# EAGLE design USB hub & FTDI (EAGLE 9.6.1)
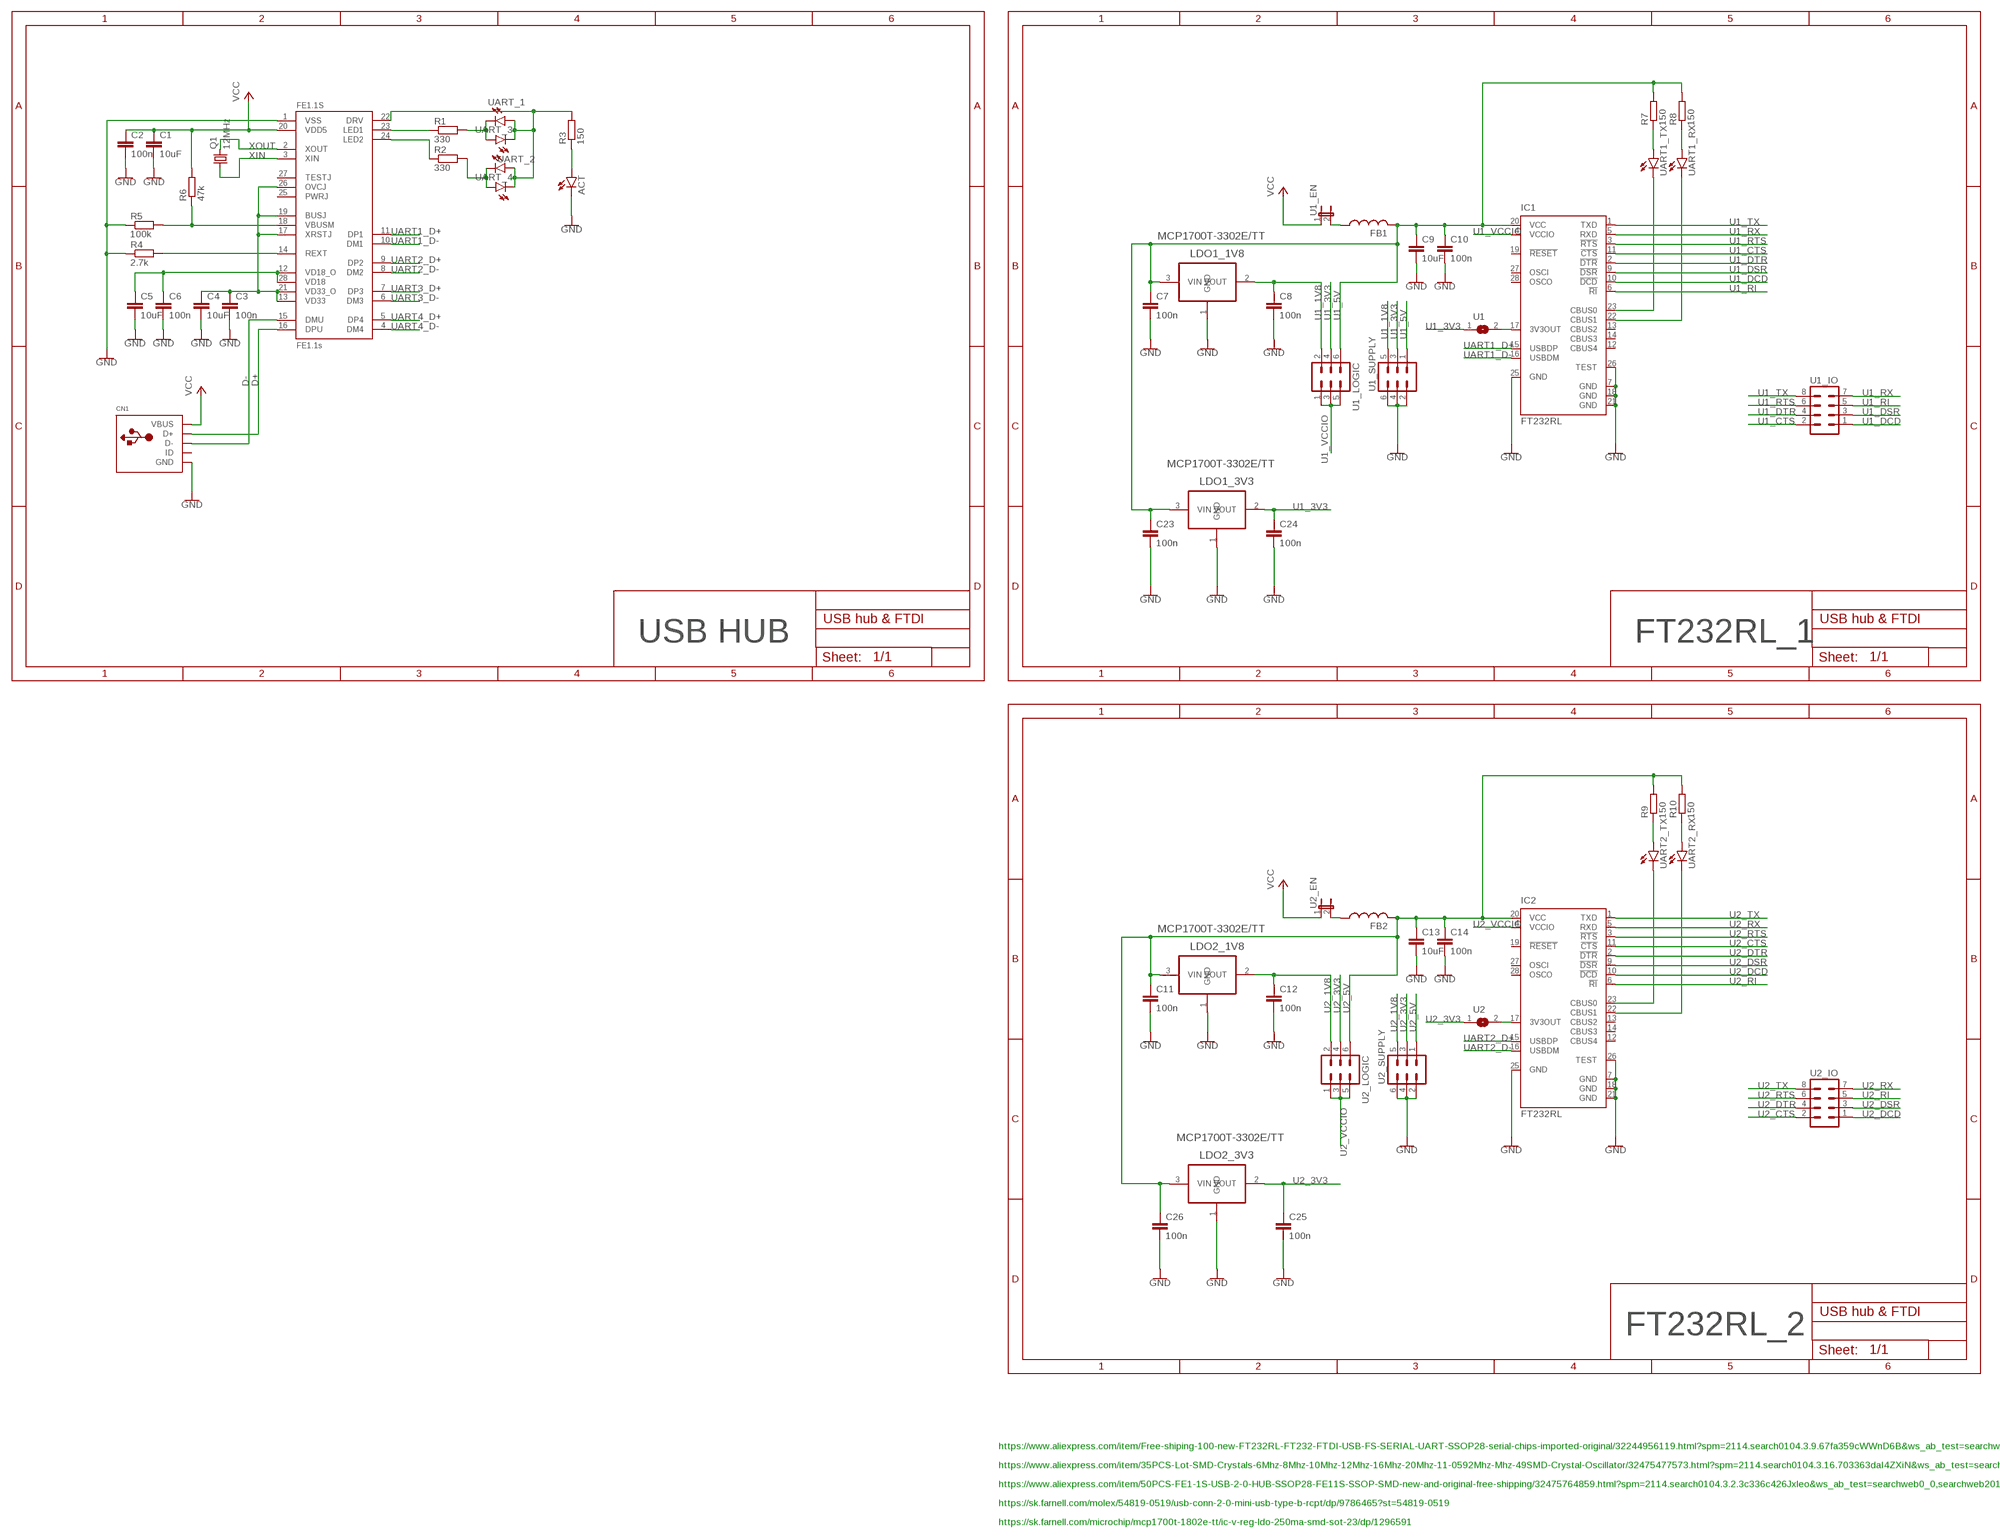
[diagram p0: schematic, sheet 1, part 1 of 2]
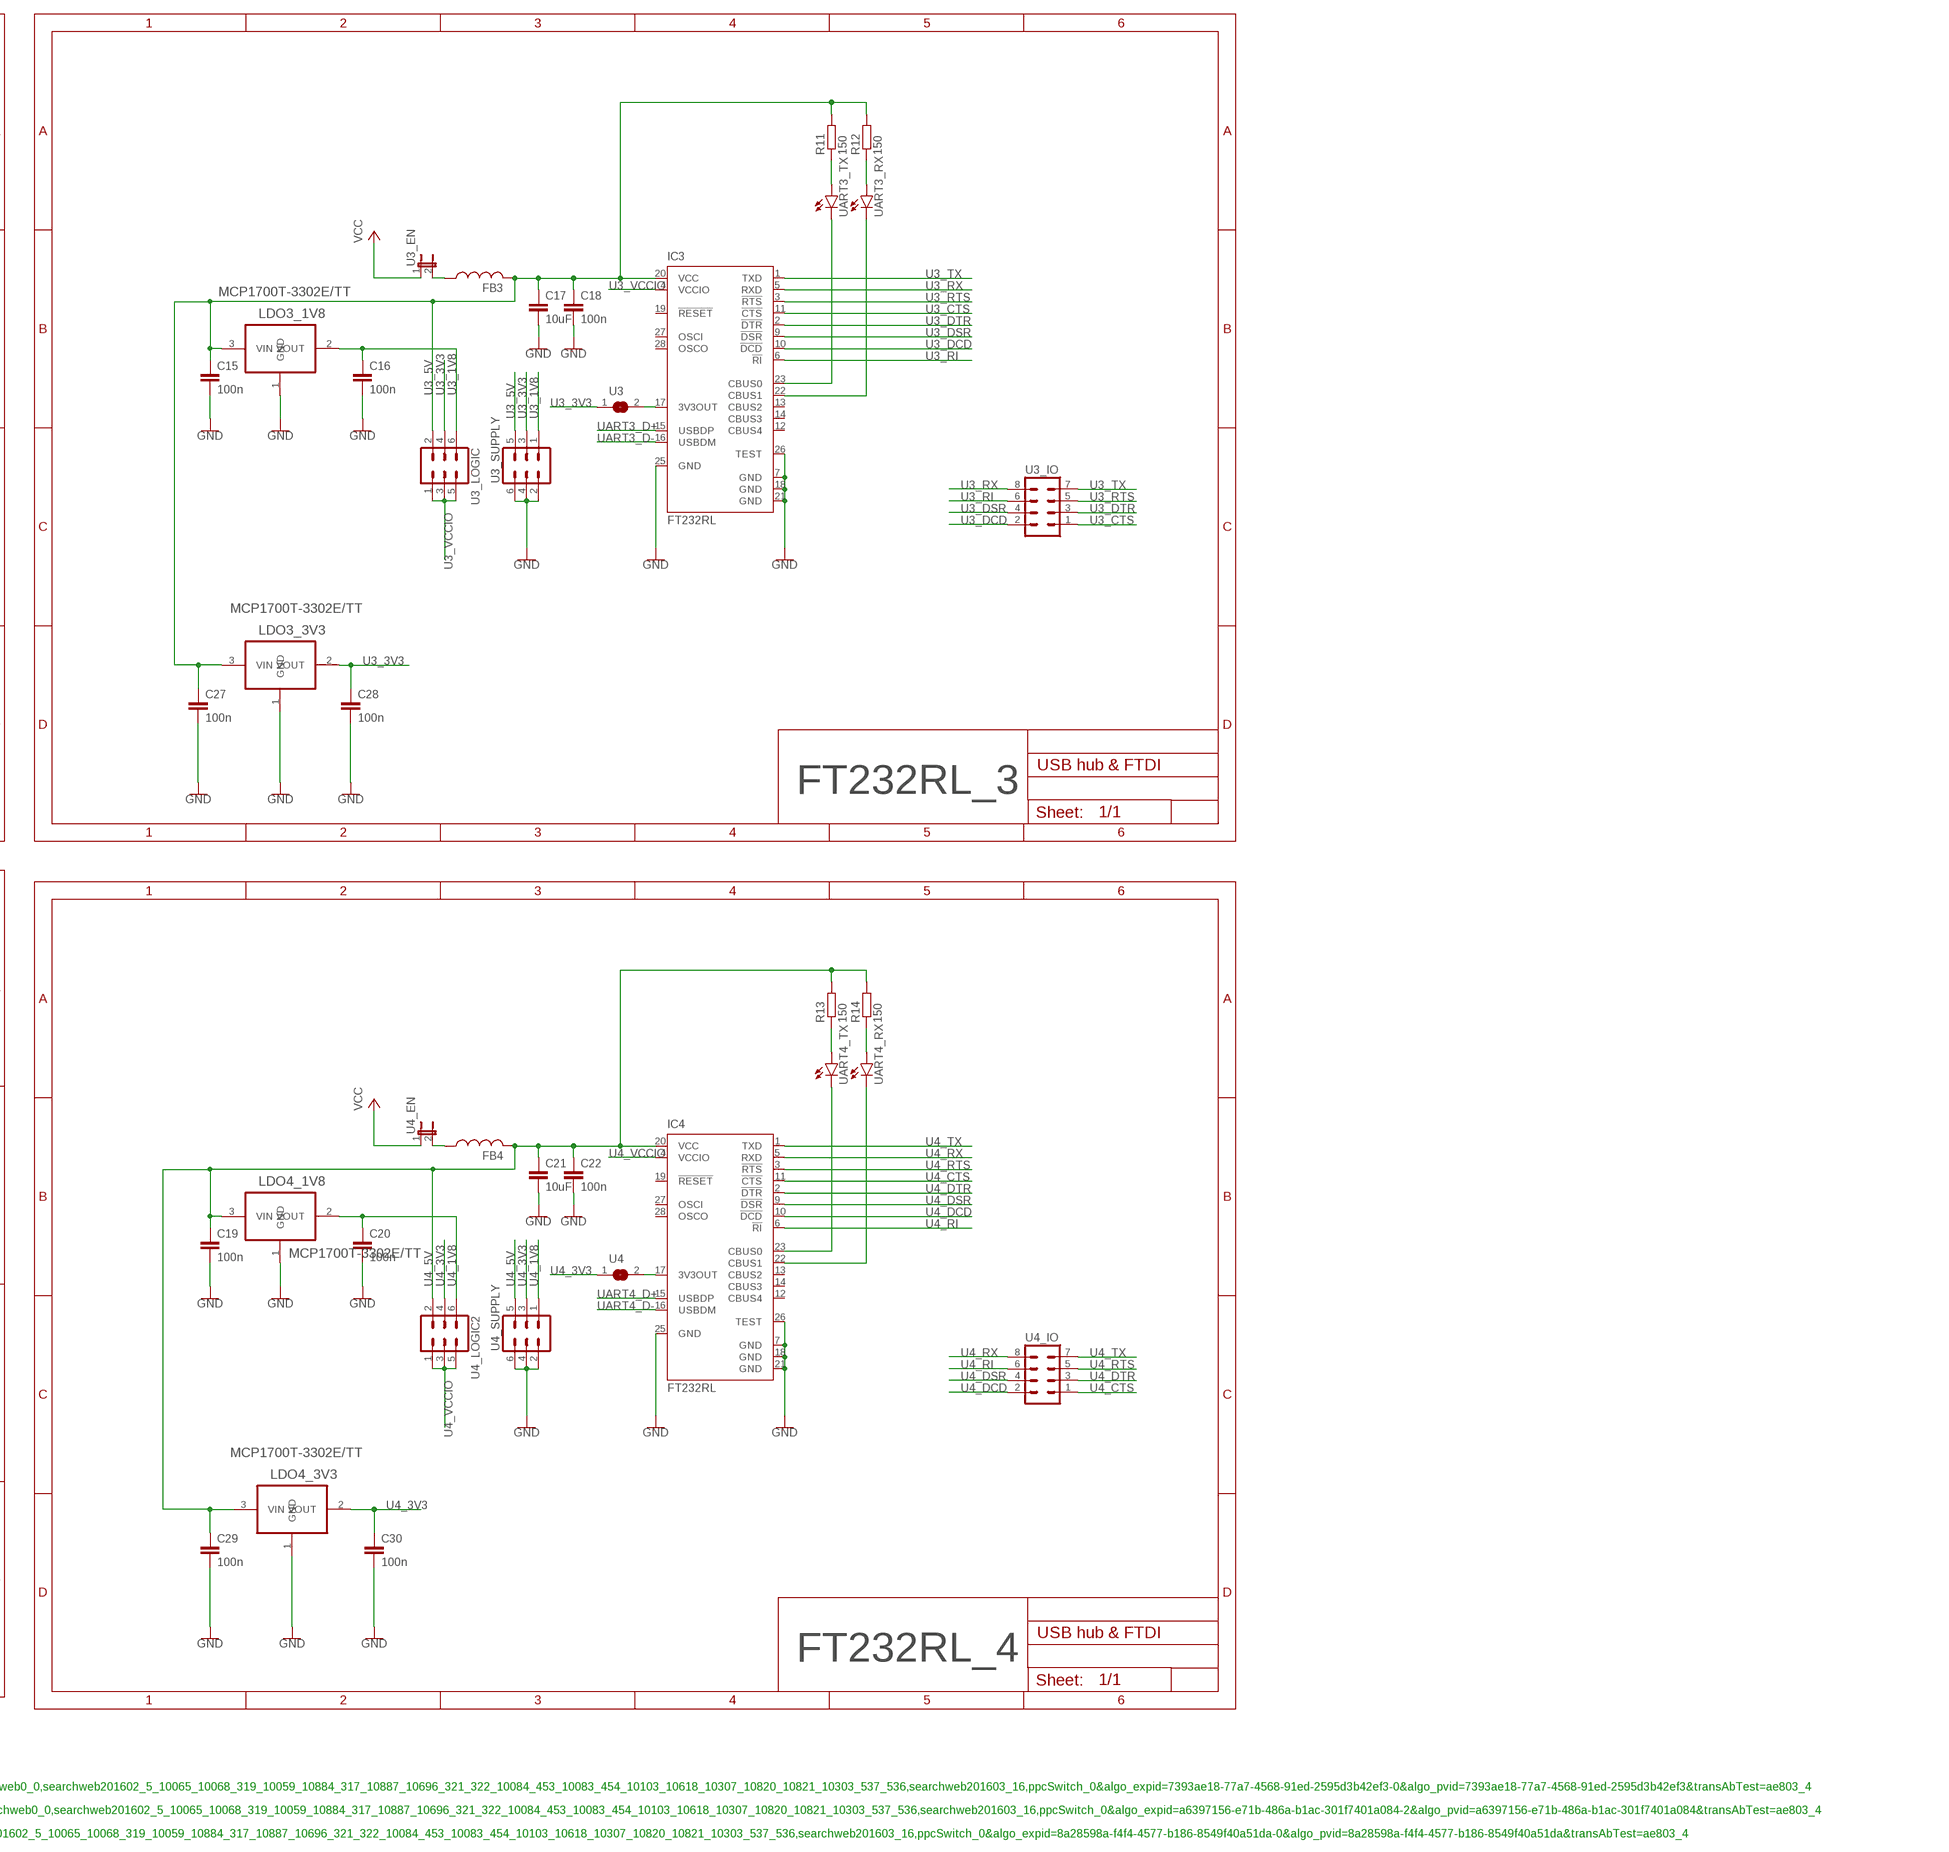
[diagram p1: schematic, sheet 1, part 2 of 2]

## Parts
ACT  LEDCHIP-LED0805  [CHIP-LED0805]
C1  10uF  C-EUC0805  [C0805]
C2  100n  C-EUC0805  [C0805]
C3  100n  C-EUC0805  [C0805]
C4  10uF  C-EUC0805  [C0805]
C5  10uF  C-EUC0805  [C0805]
C6  100n  C-EUC0805  [C0805]
C7  100n  C-EUC0805  [C0805]
C8  100n  C-EUC0805  [C0805]
C9  10uF  C-EUC0805  [C0805]
C10  100n  C-EUC0805  [C0805]
C11  100n  C-EUC0805  [C0805]
C12  100n  C-EUC0805  [C0805]
C13  10uF  C-EUC0805  [C0805]
C14  100n  C-EUC0805  [C0805]
C15  100n  C-EUC0805  [C0805]
C16  100n  C-EUC0805  [C0805]
C17  10uF  C-EUC0805  [C0805]
C18  100n  C-EUC0805  [C0805]
C19  100n  C-EUC0805  [C0805]
C20  100n  C-EUC0805  [C0805]
C21  10uF  C-EUC0805  [C0805]
C22  100n  C-EUC0805  [C0805]
C23  100n  C-EUC0805  [C0805]
C24  100n  C-EUC0805  [C0805]
C25  100n  C-EUC0805  [C0805]
C26  100n  C-EUC0805  [C0805]
C27  100n  C-EUC0805  [C0805]
C28  100n  C-EUC0805  [C0805]
C29  100n  C-EUC0805  [C0805]
C30  100n  C-EUC0805  [C0805]
CN1  USBMOLEX  [USB-MINIB-THM-MOLEX]
FB1  FERRITE-BEADB  [0805]
FB2  FERRITE-BEADB  [0805]
FB3  FERRITE-BEADB  [0805]
FB4  FERRITE-BEADB  [0805]
FE1.1S  FE1.1S  [FE1.1S_SSOP-28]
IC1  FT232RL  [SSOP28]
IC2  FT232RL  [SSOP28]
IC3  FT232RL  [SSOP28]
IC4  FT232RL  [SSOP28]
LDO1_1V8  MCP1700T-3302E/TT  [SOT95P237X112-3N]
LDO1_3V3  MCP1700T-3302E/TT  [SOT95P237X112-3N]
LDO2_1V8  MCP1700T-3302E/TT  [SOT95P237X112-3N]
LDO2_3V3  MCP1700T-3302E/TT  [SOT95P237X112-3N]
LDO3_1V8  MCP1700T-3302E/TT  [SOT95P237X112-3N]
LDO3_3V3  MCP1700T-3302E/TT  [SOT95P237X112-3N]
LDO4_1V8  MCP1700T-3302E/TT  [SOT95P237X112-3N]
LDO4_3V3  MCP1700T-3302E/TT  [SOT95P237X112-3N]
Q1  12MHz  CRYSTALHC49UP  [HC49UP]
R1  330  R-EU_R0805W  [R0805W]
R2  330  R-EU_R0805W  [R0805W]
R3  150  R-EU_R0805W  [R0805W]
R4  2.7k  R-EU_R0805W  [R0805W]
R5  100k  R-EU_R0805W  [R0805W]
R6  47k  R-EU_R0805W  [R0805W]
R7  150  R-EU_R0805W  [R0805W]
R8  150  R-EU_R0805W  [R0805W]
R9  150  R-EU_R0805W  [R0805W]
R10  150  R-EU_R0805W  [R0805W]
R11  150  R-EU_R0805W  [R0805W]
R12  150  R-EU_R0805W  [R0805W]
R13  150  R-EU_R0805W  [R0805W]
R14  150  R-EU_R0805W  [R0805W]
U1  SJ  [SJ]
U1_EN  JP1E  [JP1]
U1_IO  MA04-2  [MA04-2]
U1_LOGIC  MA03-2  [MA03-2]
U1_SUPPLY  MA03-2  [MA03-2]
U2  SJ  [SJ]
U2_EN  JP1E  [JP1]
U2_IO  MA04-2  [MA04-2]
U2_LOGIC  MA03-2  [MA03-2]
U2_SUPPLY  MA03-2  [MA03-2]
U3  SJ  [SJ]
U3_EN  JP1E  [JP1]
U3_IO  MA04-2  [MA04-2]
U3_LOGIC  MA03-2  [MA03-2]
U3_SUPPLY  MA03-2  [MA03-2]
U4  SJ  [SJ]
U4_EN  JP1E  [JP1]
U4_IO  MA04-2  [MA04-2]
U4_LOGIC2  MA03-2  [MA03-2]
U4_SUPPLY  MA03-2  [MA03-2]
UART1_RX  LEDCHIP-LED0805  [CHIP-LED0805]
UART1_TX  LEDCHIP-LED0805  [CHIP-LED0805]
UART2_RX  LEDCHIP-LED0805  [CHIP-LED0805]
UART2_TX  LEDCHIP-LED0805  [CHIP-LED0805]
UART3_RX  LEDCHIP-LED0805  [CHIP-LED0805]
UART3_TX  LEDCHIP-LED0805  [CHIP-LED0805]
UART4_RX  LEDCHIP-LED0805  [CHIP-LED0805]
UART4_TX  LEDCHIP-LED0805  [CHIP-LED0805]
UART_1  LEDCHIP-LED0805  [CHIP-LED0805]
UART_2  LEDCHIP-LED0805  [CHIP-LED0805]
UART_3  LEDCHIP-LED0805  [CHIP-LED0805]
UART_4  LEDCHIP-LED0805  [CHIP-LED0805]

## Nets
D+: CN1.D+ FE1.1S.16(DPU)
D-: CN1.D- FE1.1S.15(DMU)
GND: ACT.C C1.2 C2.2 C3.2 C4.2 C5.2 C6.2 C7.2 C8.2 C9.2 C10.2 C11.2 C12.2 C13.2 C14.2 C15.2 C16.2 C17.2 C18.2 C19.2 C20.2 C21.2 C22.2 C23.2 C24.2 C25.2 C26.2 C27.2 C28.2 C29.2 C30.2 CN1.GND FE1.1S.1(VSS) IC1.7(GND) IC1.18(GND) IC1.21(GND) IC1.25(GND) IC1.26(TEST) IC2.7(GND) IC2.18(GND) IC2.21(GND) IC2.25(GND) IC2.26(TEST) IC3.7(GND) IC3.18(GND) IC3.21(GND) IC3.25(GND) IC3.26(TEST) IC4.7(GND) IC4.18(GND) IC4.21(GND) IC4.25(GND) IC4.26(TEST) LDO1_1V8.1(GND) LDO1_3V3.1(GND) LDO2_1V8.1(GND) LDO2_3V3.1(GND) LDO3_1V8.1(GND) LDO3_3V3.1(GND) LDO4_1V8.1(GND) LDO4_3V3.1(GND) R4.1 R5.1 U1_SUPPLY.2 U1_SUPPLY.4 U1_SUPPLY.6 U2_SUPPLY.2 U2_SUPPLY.4 U2_SUPPLY.6 U3_SUPPLY.2 U3_SUPPLY.4 U3_SUPPLY.6 U4_SUPPLY.2 U4_SUPPLY.4 U4_SUPPLY.6
N$1: FE1.1S.23(LED1) R1.1
N$2: FE1.1S.24(LED2) R2.1
N$3: R1.2 UART_1.C UART_3.A
N$4: R2.2 UART_2.C UART_4.A
N$5: C5.1 C6.1 FE1.1S.12(VD18_O) FE1.1S.28(VD18)
N$6: R9.1 UART2_TX.A
N$7: FE1.1S.22(DRV) R3.2 UART_1.A UART_2.A UART_3.C UART_4.C
N$8: R7.1 UART1_TX.A
N$9: ACT.A R3.1
N$10: FE1.1S.18(VBUSM) R5.2 R6.1
N$11: FE1.1S.14(REXT) R4.2
N$12: C3.1 C4.1 FE1.1S.13(VD33) FE1.1S.17(XRSTJ) FE1.1S.19(BUSJ) FE1.1S.21(VD33_O) FE1.1S.26(OVCJ)
N$13: R8.1 UART1_RX.A
N$14: IC1.23(CBUS0) UART1_TX.C
N$15: IC1.22(CBUS1) UART1_RX.C
N$16: R10.1 UART2_RX.A
N$17: IC2.23(CBUS0) UART2_TX.C
N$18: IC2.22(CBUS1) UART2_RX.C
N$19: FB2.1 U2_EN.2
N$20: R11.1 UART3_TX.A
N$21: R12.1 UART3_RX.A
N$22: IC3.23(CBUS0) UART3_TX.C
N$23: IC3.22(CBUS1) UART3_RX.C
N$24: FB3.1 U3_EN.2
N$25: FB1.1 U1_EN.2
N$26: R13.1 UART4_TX.A
N$27: R14.1 UART4_RX.A
N$28: IC4.23(CBUS0) UART4_TX.C
N$29: IC4.22(CBUS1) UART4_RX.C
N$30: FB4.1 U4_EN.2
N$31: IC1.17(3V3OUT) U1.2
N$32: IC2.17(3V3OUT) U2.2
N$33: IC3.17(3V3OUT) U3.2
N$35: IC4.17(3V3OUT) U4.2
U1_1V8: C8.1 LDO1_1V8.2(VOUT) U1_LOGIC.2 U1_SUPPLY.5
U1_3V3: C24.1 LDO1_3V3.2(VOUT) U1.1 U1_LOGIC.4 U1_SUPPLY.3
U1_5V: C7.1 C9.1 C10.1 C23.1 FB1.2 IC1.20(VCC) LDO1_1V8.3(VIN) LDO1_3V3.3(VIN) R7.2 R8.2 U1_LOGIC.6 U1_SUPPLY.1
U1_CTS: IC1.11(!CTS) U1_IO.2
U1_DCD: IC1.10(!DCD) U1_IO.1
U1_DSR: IC1.9(!DSR) U1_IO.3
U1_DTR: IC1.2(!DTR) U1_IO.4
U1_RI: IC1.6(!RI) U1_IO.5
U1_RTS: IC1.3(!RTS) U1_IO.6
U1_RX: IC1.5(RXD) U1_IO.7
U1_TX: IC1.1(TXD) U1_IO.8
U1_VCCIO: IC1.4(VCCIO) U1_LOGIC.1 U1_LOGIC.3 U1_LOGIC.5
U2_1V8: C12.1 LDO2_1V8.2(VOUT) U2_LOGIC.2 U2_SUPPLY.5
U2_3V3: C25.1 LDO2_3V3.2(VOUT) U2.1 U2_LOGIC.4 U2_SUPPLY.3
U2_5V: C11.1 C13.1 C14.1 C26.1 FB2.2 IC2.20(VCC) LDO2_1V8.3(VIN) LDO2_3V3.3(VIN) R9.2 R10.2 U2_LOGIC.6 U2_SUPPLY.1
U2_CTS: IC2.11(!CTS) U2_IO.2
U2_DCD: IC2.10(!DCD) U2_IO.1
U2_DSR: IC2.9(!DSR) U2_IO.3
U2_DTR: IC2.2(!DTR) U2_IO.4
U2_RI: IC2.6(!RI) U2_IO.5
U2_RTS: IC2.3(!RTS) U2_IO.6
U2_RX: IC2.5(RXD) U2_IO.7
U2_TX: IC2.1(TXD) U2_IO.8
U2_VCCIO: IC2.4(VCCIO) U2_LOGIC.1 U2_LOGIC.3 U2_LOGIC.5
U3_1V8: C16.1 LDO3_1V8.2(VOUT) U3_LOGIC.6 U3_SUPPLY.1
U3_3V3: C28.1 LDO3_3V3.2(VOUT) U3.1 U3_LOGIC.4 U3_SUPPLY.3
U3_5V: C15.1 C17.1 C18.1 C27.1 FB3.2 IC3.20(VCC) LDO3_1V8.3(VIN) LDO3_3V3.3(VIN) R11.2 R12.2 U3_LOGIC.2 U3_SUPPLY.5
U3_CTS: IC3.11(!CTS) U3_IO.1
U3_DCD: IC3.10(!DCD) U3_IO.2
U3_DSR: IC3.9(!DSR) U3_IO.4
U3_DTR: IC3.2(!DTR) U3_IO.3
U3_RI: IC3.6(!RI) U3_IO.6
U3_RTS: IC3.3(!RTS) U3_IO.5
U3_RX: IC3.5(RXD) U3_IO.8
U3_TX: IC3.1(TXD) U3_IO.7
U3_VCCIO: IC3.4(VCCIO) U3_LOGIC.1 U3_LOGIC.3 U3_LOGIC.5
U4_1V8: C20.1 LDO4_1V8.2(VOUT) U4_LOGIC2.6 U4_SUPPLY.1
U4_3V3: C30.1 LDO4_3V3.2(VOUT) U4.1 U4_LOGIC2.4 U4_SUPPLY.3
U4_5V: C19.1 C21.1 C22.1 C29.1 FB4.2 IC4.20(VCC) LDO4_1V8.3(VIN) LDO4_3V3.3(VIN) R13.2 R14.2 U4_LOGIC2.2 U4_SUPPLY.5
U4_CTS: IC4.11(!CTS) U4_IO.1
U4_DCD: IC4.10(!DCD) U4_IO.2
U4_DSR: IC4.9(!DSR) U4_IO.4
U4_DTR: IC4.2(!DTR) U4_IO.3
U4_RI: IC4.6(!RI) U4_IO.6
U4_RTS: IC4.3(!RTS) U4_IO.5
U4_RX: IC4.5(RXD) U4_IO.8
U4_TX: IC4.1(TXD) U4_IO.7
U4_VCCIO: IC4.4(VCCIO) U4_LOGIC2.1 U4_LOGIC2.3 U4_LOGIC2.5
UART1_D+: FE1.1S.11(DP1) IC1.15(USBDP)
UART1_D-: FE1.1S.10(DM1) IC1.16(USBDM)
UART2_D+: FE1.1S.9(DP2) IC2.15(USBDP)
UART2_D-: FE1.1S.8(DM2) IC2.16(USBDM)
UART3_D+: FE1.1S.7(DP3) IC3.15(USBDP)
UART3_D-: FE1.1S.6(DM3) IC3.16(USBDM)
UART4_D+: FE1.1S.5(DP4) IC4.15(USBDP)
UART4_D-: FE1.1S.4(DM4) IC4.16(USBDM)
VCC: C1.1 C2.1 CN1.VBUS FE1.1S.20(VDD5) R6.2 U1_EN.1 U2_EN.1 U3_EN.1 U4_EN.1
XIN: FE1.1S.3(XIN) Q1.1
XOUT: FE1.1S.2(XOUT) Q1.2
Unconnected: CN1.ID FE1.1S.25(PWRJ) FE1.1S.27(TESTJ) IC1.12(CBUS4) IC1.13(CBUS2) IC1.14(CBUS3) IC1.19(!RESET) IC1.27(OSCI) IC1.28(OSCO) IC2.12(CBUS4) IC2.13(CBUS2) IC2.14(CBUS3) IC2.19(!RESET) IC2.27(OSCI) IC2.28(OSCO) IC3.12(CBUS4) IC3.13(CBUS2) IC3.14(CBUS3) IC3.19(!RESET) IC3.27(OSCI) IC3.28(OSCO) IC4.12(CBUS4) IC4.13(CBUS2) IC4.14(CBUS3) IC4.19(!RESET) IC4.27(OSCI) IC4.28(OSCO)

## Notes on the sheet
- USB HUB | FT232RL_1 | FT232RL_3
- FT232RL_2 | FT232RL_4
- https://www.aliexpress.com/item/Free-shiping-100-new-FT232RL-FT232-FTDI-USB-FS-SERIAL-UART-SSOP28-serial-chips-imported-original/32244956119.html?spm=2114.search0104.3.9.67fa359cWWnD6B&ws_ab_test=searchweb0_0,searchweb201602_5_10065_10068_319_10059_10884_317_10887_10696_321_322_10084_453_10083_454_10103_10618_10307_10820_10821_10303_537_536,searchweb201603_16,ppcSwitch_0&algo_expid=7393ae18-77a7-4568-91ed-2595d3b42ef3-0&algo_pvid=7393ae18-77a7-4568-91ed-2595d3b42ef3&transAbTest=ae803_4
- https://www.aliexpress.com/item/35PCS-Lot-SMD-Crystals-6Mhz-8Mhz-10Mhz-12Mhz-16Mhz-20Mhz-11-0592Mhz-Mhz-49SMD-Crystal-Oscillator/32475477573.html?spm=2114.search0104.3.16.703363daI4ZXiN&ws_ab_test=searchweb0_0,searchweb201602_5_10065_10068_319_10059_10884_317_10887_10696_321_322_10084_453_10083_454_10103_10618_10307_10820_10821_10303_537_536,searchweb201603_16,ppcSwitch_0&algo_expid=a6397156-e71b-486a-b1ac-301f7401a084-2&algo_pvid=a6397156-e71b-486a-b1ac-301f7401a084&transAbTest=ae803_4
- https://www.aliexpress.com/item/50PCS-FE1-1S-USB-2-0-HUB-SSOP28-FE11S-SSOP-SMD-new-and-original-free-shipping/32475764859.html?spm=2114.search0104.3.2.3c336c426Jxleo&ws_ab_test=searchweb0_0,searchweb201602_5_10065_10068_319_10059_10884_317_10887_10696_321_322_10084_453_10083_454_10103_10618_10307_10820_10821_10303_537_536,searchweb201603_16,ppcSwitch_0&algo_expid=8a28598a-f4f4-4577-b186-8549f40a51da-0&algo_pvid=8a28598a-f4f4-4577-b186-8549f40a51da&transAbTest=ae803_4
- https://sk.farnell.com/molex/54819-0519/usb-conn-2-0-mini-usb-type-b-rcpt/dp/9786465?st=54819-0519
- https://sk.farnell.com/microchip/mcp1700t-1802e-tt/ic-v-reg-ldo-250ma-smd-sot-23/dp/1296591

## Library data of the parts
ACT UART1_RX UART1_TX UART2_RX UART2_TX UART3_RX UART3_TX UART4_RX UART4_TX UART_1-UART_4 = led:LED: LED OSRAM: - CHIPLED LG R971, LG N971, LY N971, LG Q971, LY Q971, LO R971, LY R971 LH N974, LH R974 LS Q976, LO Q976, LY Q976 LO Q996 - Hyper CHIPLED LW Q18S LB Q993, LB Q99A, LB R99A - SideLED LS A670, LO A670, LY A670, LG A670, LP A670 LB A673, LV A673, LT A673, LW A673 LH A674 LY A675 LS A676, LA A676, LO A676, LY A676, LW A676 LS A679, LY A679, LG A679 - Hyper Micro SIDELED® LS Y876, LA Y876, LO Y876, LY Y876 LT Y87S - SmartLED LW L88C, LW L88S LB L89C, LB L89S, LG L890 LS L89K, LO L89K, LY L89K LS L896, LA L896, LO L896, LY L896 - TOPLED LS T670, LO T670, LY T670, LG T670, LP T670 LSG T670, LSP T670, LSY T670, LOP T670, LYG T670 LG T671, LOG T671, LSG T671 LB T673, LV T673, LT T673, LW T673 LH T674 LS T676, LA T676, LO T676, LY T676, LB T676, LH T676, LSB T676, LW T676 LB T67C, LV T67C, LT T67C, LS T67K, LO T67K, LY T67K, LW E67C LS E67B, LA E67B, LO E67B, LY E67B, LB E67C, LV E67C, LT E67C LW T67C LS T679, LY T679, LG T679 LS T770, LO T770, LY T770, LG T770, LP T770 LB T773, LV T773, LT T773, LW T773 LH T774 LS E675, LA E675, LY E675, LS T675 LS T776, LA T776, LO T776, LY T776, LB T776 LHGB T686 LT T68C, LB T68C - Hyper Mini TOPLED® LB M676 - Mini TOPLED Santana® LG M470 LS M47K, LO M47K, LY M47K Source: http://www.osram.convergy.de LUXEON: - LUMILED® LXK2-PW12-R00, LXK2-PW12-S00, LXK2-PW14-U00, LXK2-PW14-V00 LXK2-PM12-R00, LXK2-PM12-S00, LXK2-PM14-U00 LXK2-PE12-Q00, LXK2-PE12-R00, LXK2-PE12-S00, LXK2-PE14-T00, LXK2-PE14-U00 LXK2-PB12-K00, LXK2-PB12-L00, LXK2-PB12-M00, LXK2-PB14-N00, LXK2-PB14-P00, LXK2-PB14-Q00 LXK2-PR12-L00, LXK2-PR12-M00, LXK2-PR14-Q00, LXK2-PR14-R00 LXK2-PD12-Q00, LXK2-PD12-R00, LXK2-PD12-S00 LXK2-PH12-R00, LXK2-PH12-S00 LXK2-PL12-P00, LXK2-PL12-Q00, LXK2-PL12-R00 Source: www.luxeon.com KINGBRIGHT: KA-3528ASYC Source: www.kingbright.com
C1-C30 = rcl:C-EU: CAPACITOR, European symbol; SPICEPREFIX: C
CN1 = adafruit:USB: USB Connectors USBMINIB - Surface Mount Female Mini-B USB Connector 4UConnector: 06564 By microbuilder.eu Thru-hole RA Female Mini-B USB Connector 4UConnector: 18732 By ladyada.net
FB1-FB4 = m-pad-2.1:FERRITE-BEAD: Ferrite beads in various packages
FE1.1S = Ai_IC:FE1.1S
IC1-IC4 = ftdichip:FT232R: Source: http://www.ftdichip.com/Documents/DataSheets/DS_FT232R_v104.pdf; MPN: FT232RL; OC_FARNELL: 1146032; OC_NEWARK: 91K9918
LDO1_1V8 LDO1_3V3 LDO2_1V8 LDO2_3V3 LDO3_1V8 LDO3_3V3 LDO4_1V8 LDO4_3V3 = MCP1700T-3302E_TT:MCP1700T-3302E/TT: Low Quiescent Current LDO; AVAILABILITY: Unavailable; DESCRIPTION: MCP1700 Series 250 mA 3.3 V Fixed Output LDO Voltage Regulator - SOT-23; MF: Microchip; MP: MCP1700T-3302E/TT; PACKAGE: SOT-23-3 Microchip; PRICE: None
Q1 = adafruit:CRYSTAL: CRYSTAL; OC_FARNELL: unknown; OC_NEWARK: unknown
R1-R14 = rcl:R-EU_: RESISTOR, European symbol; SPICEPREFIX: R
U1-U4 = jumper:SJ: SMD solder JUMPER
U1_EN U2_EN U3_EN U4_EN = jumper:JP1E: JUMPER
U1_IO U2_IO U3_IO U4_IO = con-lstb:MA04-2: PIN HEADER; OC_FARNELL: unknown; OC_NEWARK: unknown
U1_LOGIC U1_SUPPLY U2_LOGIC U2_SUPPLY U3_LOGIC U3_SUPPLY U4_LOGIC2 U4_SUPPLY = con-lstb:MA03-2: PIN HEADER; OC_FARNELL: unknown; OC_NEWARK: unknown

## Board
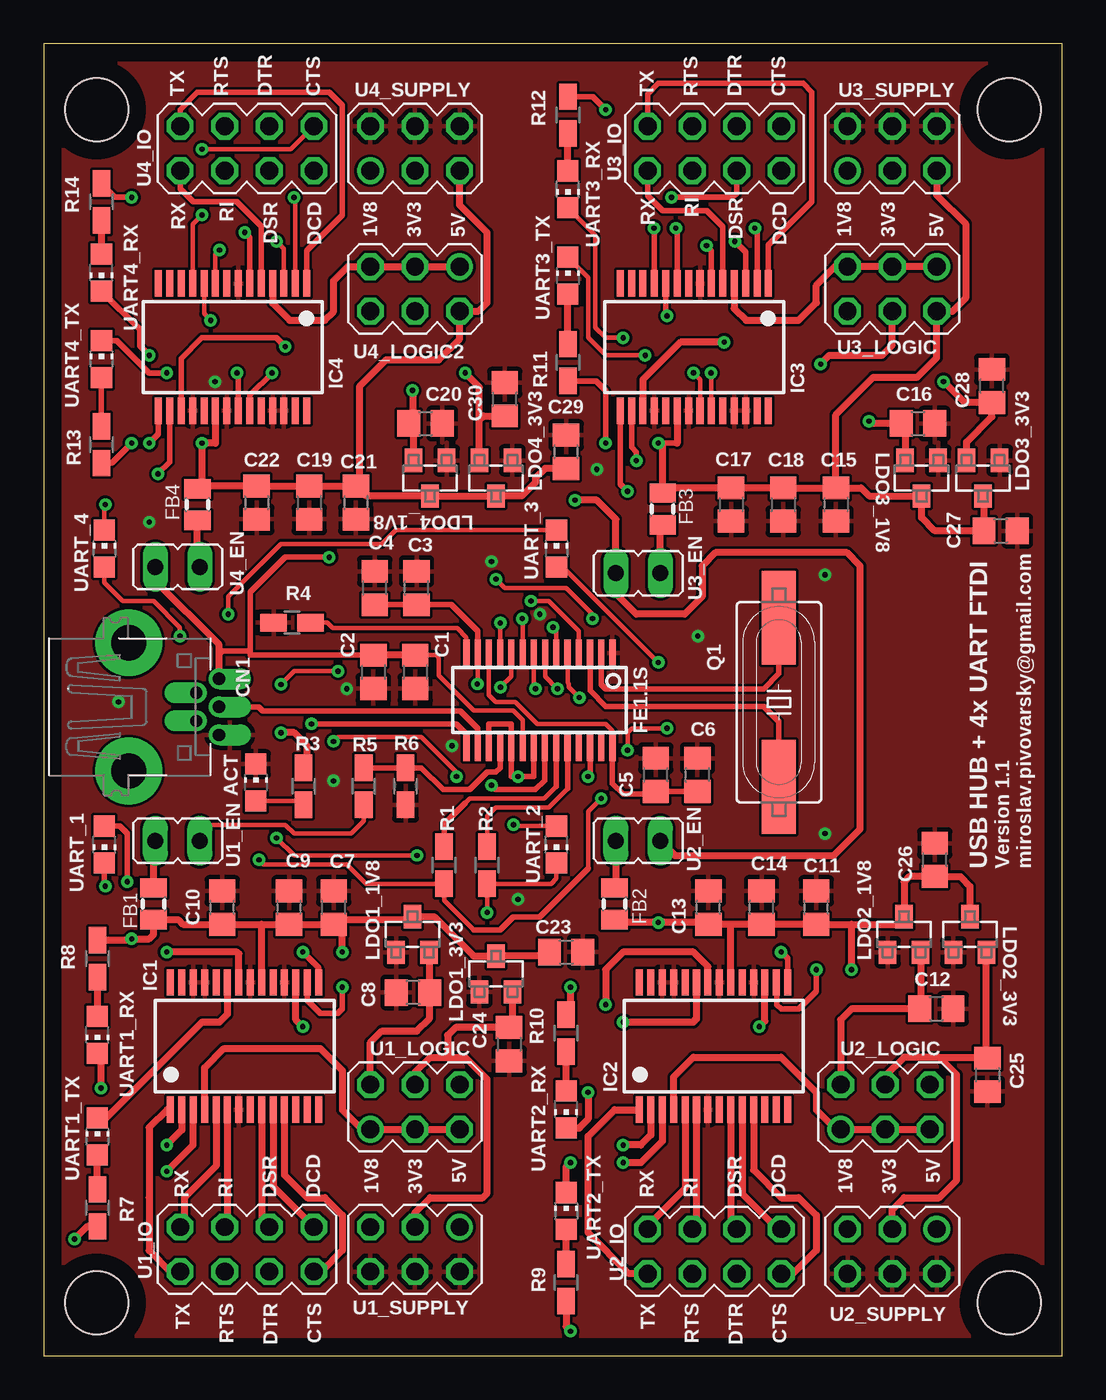
[diagram p2: board, top side]
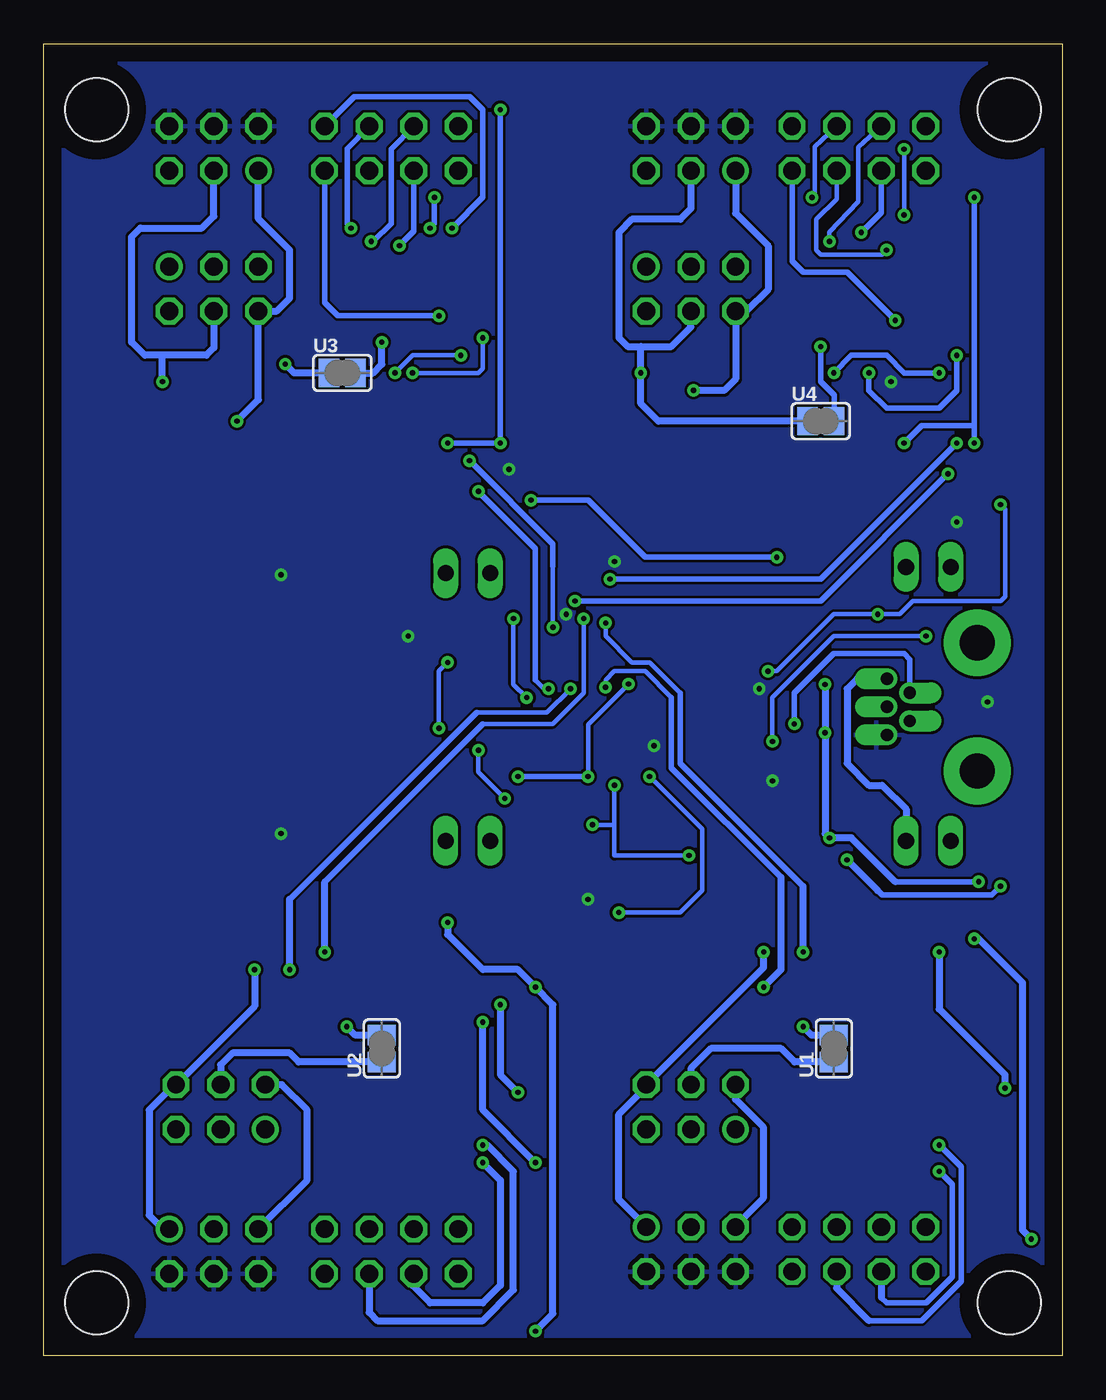
[diagram p3: board, bottom side, seen from below]

Size 58 x 74.75 mm. Coordinates in mm from the lower left corner, seen from the top.
Outline: 0,0 58,0 58,74.75 0,74.75 0,0
Copper layers (1*16): Top 0.035mm / dielectric 1.5mm / Bottom 0.035mm
Design rules "default *": minimum track width 6mil, minimum drill 0.35mm, track to track 6mil, track to pad 6mil, pad to pad 6mil, via to via 6mil, smd to smd 6mil, copper to edge 40mil, drill to drill 6mil, minimum pad ring 10mil, minimum via ring 8mil, stop-mask expansion 4mil, vias tented up to drill 66mil, thermal gap 10mil
Holes 3.6 mm at 55,71 3,71 3,3 55,3

### Footprints (pad centres in the part's own frame; a part is rotated, then mirrored left to right if it is on the bottom)
CHIP-LED0805 = smd 1.2 x 1.2: A 0,-1.05; C 0,1.05
C0805 = smd 1.3 x 1.5: 1 -0.95,0; 2 0.95,0
USB-MINIB-THM-MOLEX = drill 0.7 offset: D+ 0,9.72; D- -0.8,8.42; GND 1.6,9.72; ID 0.8,8.42; VBUS -1.6,9.72 | drill 2 pad 3.81: GND1 -3.65,4.57; GND4 3.65,4.57
0805 = smd 1.1 x 1.5: 1 -0.9,0; 2 0.9,0
FE1.1S_SSOP-28 = smd 0.35 x 1.5: 1 -4.16,-2.7; 2 -3.52,-2.7; 3 -2.88,-2.7; 4 -2.24,-2.7; 5 -1.6,-2.7; 6 -0.96,-2.7; 7 -0.32,-2.7; 8 0.32,-2.7; 9 0.96,-2.7; 10 1.6,-2.7; 11 2.24,-2.7; 12 2.88,-2.7; 13 3.52,-2.7; 14 4.16,-2.7; 15 4.16,2.7; 16 3.52,2.7; 17 2.88,2.7; 18 2.24,2.7; 19 1.6,2.7; 20 0.96,2.7; 21 0.32,2.7; 22 -0.3,2.7; 23 -0.96,2.7; 24 -1.6,2.7; 25 -2.24,2.7; 26 -2.88,2.7; 27 -3.52,2.7; 28 -4.16,2.7
SSOP28 = smd 0.4 x 1.5: 1 -4.225,-3.625; 2 -3.575,-3.625; 3 -2.925,-3.625; 4 -2.275,-3.625; 5 -1.625,-3.625; 6 -0.975,-3.625; 7 -0.325,-3.625; 8 0.325,-3.625; 9 0.975,-3.625; 10 1.625,-3.625; 11 2.275,-3.625; 12 2.925,-3.625; 13 3.575,-3.625; 14 4.225,-3.625; 15 4.225,3.625; 16 3.575,3.625; 17 2.925,3.625; 18 2.275,3.625; 19 1.625,3.625; 20 0.975,3.625; 21 0.325,3.625; 22 -0.325,3.625; 23 -0.975,3.625; 24 -1.625,3.625; 25 -2.275,3.625; 26 -2.925,3.625; 27 -3.575,3.625; 28 -4.225,3.625
SOT95P237X112-3N = smd 0.991 x 1.321: 1 -0.94,-1.016; 2 0.94,-1.016; 3 0,1.016
HC49UP = smd 5.334 x 1.93: 1 -4.826,0; 2 4.826,0
R0805W = smd 1.5 x 1: 1 -1.052,0; 2 1.052,0
SJ = smd 1.168 x 1.6: 1 -0.762,0; 2 0.762,0
JP1 = drill 0.914 long: 1 0,-1.27; 2 0,1.27
MA04-2 = drill 1.016 octagon: 1 -3.81,-1.27; 2 -3.81,1.27; 3 -1.27,-1.27; 4 -1.27,1.27; 5 1.27,-1.27; 6 1.27,1.27; 7 3.81,-1.27; 8 3.81,1.27
MA03-2 = drill 1.016: 1 -2.54,-1.27 | drill 1.016 octagon: 2 -2.54,1.27; 3 0,-1.27; 4 0,1.27; 5 2.54,-1.27; 6 2.54,1.27

### Placement (x,y rotation side)
ACT  12.08,32.66 0 top
C1  21.15,38.96 270 top
C2  18.77,38.96 270 top
C3  21.23,43.74 90 top
C4  18.85,43.74 90 top
C5  34.85,33.09 90 top
C6  37.23,33.09 90 top
C7  16.51,25.53 90 top
C8  21.03,20.69 180 top
C9  13.97,25.53 90 top
C10  10.16,25.53 90 top
C11  44,25.53 90 top
C12  50.84,19.77 0 top
C13  37.85,25.53 90 top
C14  40.88,25.53 90 top
C15  45.12,48.5 270 top
C16  49.79,53.12 0 top
C17  39.15,48.5 270 top
C18  42.12,48.5 270 top
C19  15.12,48.61 270 top
C20  21.74,53.12 0 top
C21  17.77,48.61 270 top
C22  12.12,48.61 270 top
C23  29.75,23 0 top
C24  26.5,17.75 270 top
C25  53.75,16 270 top
C26  50.75,28.25 90 top
C27  54.5,47 0 top
C28  54,55.25 90 top
C29  29.75,51.5 90 top
C30  26.25,54.5 90 top
CN1  0.26,36.97 270 top
FB1  6.25,25.75 270 top
FB2  32.5,25.75 270 top
FB3  35.25,48.25 90 top
FB4  8.75,48.5 90 top
FE1.1S  28.23,37.35 180 top
IC1  11.43,17.64 0 top
IC2  38.15,17.64 0 top
IC3  37.05,57.47 180 top
IC4  10.75,57.47 180 top
LDO1_1V8  21,24 0 top
LDO1_3V3  25.75,21.75 0 top
LDO2_1V8  49,24 0 top
LDO2_3V3  52.75,24 0 top
LDO3_1V8  50,50 180 top
LDO3_3V3  53.5,50 180 top
LDO4_1V8  22,50 180 top
LDO4_3V3  25.75,50 180 top
Q1  41.87,37.23 90 top
R1  22.8,27.94 270 top
R2  25.25,27.94 270 top
R3  14.8,32.44 90 top
R4  14.14,41.77 0 top
R5  20.6,32.44 90 top
R6  18.22,32.44 270 top
R7  3.05,8.42 270 top
R8  3.05,22.62 90 top
R9  29.75,4.17 270 top
R10  29.75,18.37 90 top
R11  29.85,56.59 270 top
R12  29.85,70.69 90 top
R13  3.28,51.91 270 top
R14  3.28,65.74 90 top
U1  13,17.5 90 bottom
U1_EN  7.62,29.34 90 top
U1_IO  11.57,6.06 180 top
U1_LOGIC  21.14,14.17 0 top
U1_SUPPLY  21.14,6.06 180 top
U2  38.75,17.5 90 bottom
U2_EN  33.85,29.34 90 top
U2_IO  38.2,5.94 180 top
U2_LOGIC  47.93,14.17 0 top
U2_SUPPLY  48.32,5.94 180 top
U3  41,56 0 bottom
U3_EN  33.85,44.59 270 top
U3_IO  38.2,68.79 180 top
U3_LOGIC  48.32,60.79 180 top
U3_SUPPLY  48.32,68.79 0 top
U4  13.75,53.25 0 bottom
U4_EN  7.62,44.94 270 top
U4_IO  11.57,68.79 180 top
U4_LOGIC2  21.14,60.79 180 top
U4_SUPPLY  21.14,68.79 0 top
UART1_RX  3.05,18.28 180 top
UART1_TX  3.05,12.49 0 top
UART2_RX  29.75,14.03 180 top
UART2_TX  29.75,8.24 0 top
UART3_RX  29.85,66.46 180 top
UART3_TX  29.85,61.54 0 top
UART4_RX  3.28,61.71 180 top
UART4_TX  3.28,56.79 0 top
UART_1  3.45,29.12 180 top
UART_2  29.2,29.12 180 top
UART_3  29.2,45.99 0 top
UART_4  3.45,45.99 0 top

### Tracks (layer width: path | path; a pad name or v marks a point on that pad's centre or on a via)
D+
  Top 0.305: CN1.D+ 12.23,36.97 12.48,36.72 23.72,36.72 24.71,35.73 FE1.1S.16
D-  (via drill 0.3)
  Top 0.305: FE1.1S.15 24.07,35.43 23.5,36 v15.25,36
  Bottom 0.305: CN1.D- 8.68,39.68 9,40 13,40 15.25,37.75 v15.25,36
GND  (via drill 0.3)
  other vias: 25.5,45.25 17.25,38 27,26 9.75,55.5 23.25,34.75 6,47.5 4.25,37.25 16.5,32.75 37.25,41 44.5,44.5 44.5,29.75 31.5,50.5 28.25,42.25
  pour Bottom: 0,74.75 58,74.75 58,0 0,0
  pour Top: 0,74.75 58,74.75 58,0 0,0
N$1
  Top 0.254: 29.19,32.44 28.5,31.75 24.25,31.75 24,31.5
  Top 0.305: FE1.1S.23 29.19,32.44 | R1.1 22.8,30.3 24,31.5
N$2
  Top 0.254: 29.83,32.33 28.75,31.25 25.75,31.25 25.25,30.75 R2.1
  Top 0.305: FE1.1S.24 29.83,32.33
N$3  (via drill 0.3)
  Top 0.254: 24.5,24.25 22.8,25.95 R1.2 18.36,26.89 17.25,28 12.5,28 v12.25,28.25 | 31,27.75 31,31 v31.75,31.75 | v33.25,34.5 33.25,35.5 33.5,35.75 v35.5,35.75 | UART_3.A 29.56,44.94 v35,39.5
  Top 0.305: UART_1.C 3.45,26.8 v3.5,26.75 | 24.5,24.25 26,24.25 26.75,25 28.25,25 31,27.75
  Bottom 0.254: v31.75,31.75 33.25,33.25 v33.25,34.5 | v35.5,35.75 35.5,39 v35,39.5
  Bottom 0.305: 10.5,26.5 10.25,26.25 4,26.25 v3.5,26.75
  Bottom 0.406: v12.25,28.25 10.5,26.5
N$4  (via drill 0.3)
  Top 0.254: v7.75,41 7.75,41.5 6.25,43 4.5,43 3.45,44.05 UART_4.A | v25.25,25.25 R2.2 28.89,26.89 29.2,27.2 UART_2.C | v23.5,33 23.5,33.25 21.5,35.25 16.75,35.25 v16.5,35
  Bottom 0.254: v7.75,41 13,41 16.5,37.5 v16.5,35 | v25.25,25.25 21.75,25.25 20.5,26.5 20.5,30 v23.5,33
N$5
  Top 0.254: FE1.1S.12 25.35,37.65 25.75,37.25 26.86,37.25 28.11,36 32,36 32.39,35.61 FE1.1S.28
  Top 0.305: C6.1 C5.1 34.71,32 33,32 32.39,32.61 FE1.1S.28
N$6
  Top 0.406: R9.1 UART2_TX.A
N$7  (via drill 0.3)
  Top 0.254: v16.75,39 14.25,39 v13.5,38.25 | UART_3.C 20.04,47.04 19.25,46.25 13.5,46.25 10.5,43.25 v10.5,42.25 | v13.25,29.5 14.25,28.5 v21.25,28.5 | UART_2.A 26.83,30.17 v26.75,30.25 | UART_4.C 3.45,48.45 v3.5,48.5
  Top 0.305: R3.2 15,33.69 | v4.75,27 4.75,29.75 4.33,30.17 UART_1.A | FE1.1S.22 28.53,32.78 28,32.25 25.75,32.25 v25.5,32.5
  Top 0.406: 15,33.69 15,34.75 14.25,35.5 v13.5,35.5
  Bottom 0.254: v16.75,39 16.25,39 13,42.25 v10.5,42.25 9.25,42.25 8.5,43 3.5,43 3.25,43.25 3.25,48.25 v3.5,48.5 | v21.25,28.5 25.5,28.5 25.5,30.25 | v25.5,32.5 25.5,30.25 | v26.75,30.25 25.5,30.25
  Bottom 0.305: v4.75,27 9.5,27
  Bottom 0.406: 9.5,27 12,29.5 v13.25,29.5 13.5,29.75 v13.5,35.5 v13.5,38.25
N$8
  Top 0.406: R7.1 UART1_TX.A
N$9
  Top 0.254: ACT.A 14.58,31.61 R3.1
N$10
  Top 0.305: R5.2 R6.1 21.51,33.49 22.75,32.25 24.25,32.25 25.25,33.25 25.75,33.25 25.99,33.49 FE1.1S.18
N$11
  Top 0.254: R4.2 16.13,41.77 16.45,41.45 23,41.45 23.3,41.45 23.55,41.45 24.07,40.93 FE1.1S.14
N$12  (via drill 0.3)
  Top 0.254: FE1.1S.13 24.71,38.29 v24.69,38.27
  Top 0.305: C4.1 C3.1 23.21,42.79 24.71,41.29 FE1.1S.13 | FE1.1S.17 25.35,36 26.63,36 FE1.1S.19 26.63,33 v27,33 27.91,33 FE1.1S.21 | FE1.1S.26 31.11,33.11 v31,33
  Bottom 0.254: v24.69,38.27 27,35.97 v27,33
  Bottom 0.305: v27,33 v31,33
N$13
  Top 0.406: UART1_RX.A 3.07,19.62 3.07,21.55 R8.1
N$14
  Top 0.406: IC1.23 10.46,19.45 10,19 9,19 3.54,13.54 UART1_TX.C
N$15  (via drill 0.3)
  Top 0.406: IC1.22 11.11,22.89 11,23 v7,23 | UART1_RX.C 3.25,17.03 v3.25,15.25
  Bottom 0.406: v3.25,15.25 3.25,16 7,19.75 v7,23
N$16
  Top 0.406: UART2_RX.A R10.1
N$17  (via drill 0.3)
  Top 0.406: IC2.23 37.17,19.18 37,19 v33,19 | UART2_TX.C 29.75,10.75 v30,11
  Bottom 0.406: v33,19 33,14 v30,11
N$18  (via drill 0.3)
  Top 0.406: IC2.22 37.83,22.18 37,23 33,23 32,22 v32,20 | v31,15 31,13.48 30.5,12.98 UART2_RX.C
  Bottom 0.406: v31,15 32,16 v32,20
N$19
  Top 0.406: U2_EN.2 32.58,26.73 FB2.1
N$20
  Top 0.406: R11.1 UART3_TX.A
N$21
  Top 0.406: UART3_RX.A R12.1
N$22  (via drill 0.3)
  Top 0.254: UART3_TX.C 31,61.44 31,58 32,57 v34.25,57 | IC3.23 38.02,55.98 v38,56
  Bottom 0.254: v34.25,57 37,57 v38,56
N$23  (via drill 0.3)
  Top 0.254: UART3_RX.C 31.41,63.85 31.41,58.59 32,58 v33,58 | IC3.22 37.38,55.62 v37,56
  Bottom 0.254: v33,58 33,56.25 33.25,56 v37,56
N$24
  Top 0.406: U3_EN.2 35.12,47.22 FB3.1
N$25
  Top 0.406: FB1.1 6.25,29.24 U1_EN.2
N$26
  Top 0.305: R13.1 UART4_TX.A
N$27
  Top 0.406: R14.1 UART4_RX.A
N$28  (via drill 0.3)
  Top 0.305: UART4_TX.C 4.16,57.84 6,56 v7,56 | IC4.23 11.72,54.73 v13,56
  Bottom 0.305: v7,56 9,56 10,57 12,57 v13,56
N$29  (via drill 0.3)
  Top 0.305: UART4_RX.C 5.46,58.48 5.46,57.54 v6,57 | IC4.22 11.07,55.92 v11,56
  Bottom 0.305: v6,57 6,55 7,54 10,54 11,55 v11,56
N$30
  Top 0.406: U4_EN.2 8.75,45.08 FB4.1
N$31  (via drill 0.3)
  Top 0.406: v14.75,18.75 14.36,19.14 IC1.17
  Bottom 0.406: U1.2 14.26,18.26 v14.75,18.75
N$32  (via drill 0.3)
  Top 0.406: v40.75,18.75 41.08,19.07 IC2.17
  Bottom 0.406: U2.2 40.26,18.26 v40.75,18.75
N$33  (via drill 0.3)
  Top 0.406: v38.75,57.75 36.25,57.75 34.12,55.62 IC3.17
  Bottom 0.406: U3.2 39.25,56 38.75,56.5 v38.75,57.75
N$35  (via drill 0.3)
  Top 0.305: IC4.17 7.83,56.83 9,58 13.25,58 v13.75,57.5
  Bottom 0.305: v13.75,57.5 13.75,55.5 12.99,54.74 U4.2
U1_1V8
  Top 0.406: U1_LOGIC.2 18.6,17.85 19.25,18.5 21.25,18.5 21.98,19.23 C8.1 21.94,20.73 LDO1_1V8.2
  Bottom 0.406: U1_SUPPLY.5 18.6,7.4 17,9 17,13 18.6,14.6 U1_LOGIC.2
U1_3V3
  Top 0.406: U1_SUPPLY.3 21.14,8.14 22,9 25,9 25.25,9.25 25.25,15.75 24,17 23,17 | 23,17 22,17 21.14,16.14 U1_LOGIC.4 | LDO1_3V3.2 26.69,18.89 C24.1 23.45,18.7 23,18.25 23,17
  Bottom 0.406: U1.1 15.24,16.74 16,17.5 20,17.5 21.14,16.36 U1_LOGIC.4
U1_5V  (via drill 0.3)
  Top 0.406: 12.4,24.58 C10.1 7.92,24.58 7.65,24.85 FB1.2 6.25,24 6,23.75 v5,23.75 4.92,23.67 R8.2 | 12.4,24.58 C9.1 C7.1 16.51,24.82 17,24.82 | IC1.20 12.4,24.58 | v17,23 17,24.82 | 17,24.82 20.8,24.82 arc90 LDO1_1V8.3 22.23,25.02 24.48,22.77 LDO1_3V3.3 28.57,22.77 C23.1 | R7.2 2.47,7.37 v1.75,6.64
  Bottom 0.406: v17,23 17,22.12 U1_LOGIC.6 23.68,15.32 25.25,13.75 25.25,8.9 U1_SUPPLY.1 | v1.75,6.64 2.25,7.14 2.25,21.25 4.75,23.75 v5,23.75
U1_CTS
  Top 0.406: IC1.11 13.71,10.29 15,9 16,9 17,8 17,6 15.79,4.79 U1_IO.2
U1_DCD
  Top 0.406: IC1.10 13.05,9.65 U1_IO.1
U1_DSR
  Top 0.406: IC1.9 12.4,7.76 U1_IO.3
U1_DTR  (via drill 0.3)
  Top 0.406: IC1.2 7.86,12.86 v7,12
  Bottom 0.305: v7,12 5.75,10.75 5.75,4.25 8,2 11,2
  Bottom 0.406: U1_IO.4 12.84,3.84 11,2
U1_RI
  Top 0.406: IC1.6 10.46,7.49 U1_IO.5
U1_RTS  (via drill 0.3)
  Top 0.406: v7,10.5 8.51,12.01 IC1.3
  Bottom 0.305: v7,10.5 6.25,9.75 6.25,4.5 7.75,3 10,3 10.3,3.3
  Bottom 0.406: U1_IO.6 10.3,3.3
U1_RX
  Top 0.406: IC1.5 9.8,10.8 8,9 8,7.57 U1_IO.7
U1_TX
  Top 0.406: U1_IO.8 7.21,4.79 6,6 6,9 6,13 7.01,14.02 IC1.1
U1_VCCIO
  Top 0.406: IC1.4 9.15,16.41 10.25,17.5 15.75,17.5 17,16.25 17,14 18.1,12.9 U1_LOGIC.1 U1_LOGIC.3 U1_LOGIC.5
U2_1V8
  Top 0.406: U2_LOGIC.2 45.39,19.14 46.02,19.77 C12.1 49.94,19.82 LDO2_1V8.2
  Bottom 0.406: U2_SUPPLY.5 43,10 43,14 44.44,15.44 U2_LOGIC.2
U2_3V3
  Top 0.406: U2_SUPPLY.3 48.32,8.32 49,9 51,9 52,10 52,16 51,17 | 51,17 49,17 47.93,15.93 U2_LOGIC.4 | LDO2_3V3.2 53.69,17.01 C25.1 53.7,17 51,17
  Bottom 0.406: U2.1 43.49,16.74 44,17.25 47.25,17.25 47.93,16.57 U2_LOGIC.4
U2_5V  (via drill 0.3)
  Top 0.406: 39,24.58 C14.1 C11.1 46,24.58 | 39,24.58 C13.1 37.75,24.68 v35,24.68 32.67,24.68 FB2.2 | 46,24.58 48.58,24.58 49,25 LDO2_1V8.3 49,27 49.3,27.3 C26.1 52.2,27.3 52.75,26.75 LDO2_3V3.3 | IC2.20 39.12,24.45 39,24.58 | 46,24.58 v46,22 | R9.2 29.75,1.64 v30,1.39 | R10.2 30,19.67 v30,21
  Bottom 0.406: v46,22 46,19.91 U2_LOGIC.6 50.56,15.44 52,14 52,8 51.21,7.21 U2_SUPPLY.1 | v30,1.39 29,2.39 29,20 v30,21 31,22 33,22 35,24 v35,24.68
U2_CTS
  Top 0.406: IC2.11 40.42,10.57 42,9 43,9 44,8 44,6 42.67,4.67 U2_IO.2
U2_DCD
  Top 0.406: IC2.10 39.77,9.22 41.79,7.21 U2_IO.1
U2_DSR
  Top 0.406: IC2.9 39.12,7.55 U2_IO.3
U2_DTR  (via drill 0.3)
  Top 0.406: IC2.2 34.58,12.57 34,12 v33,12
  Bottom 0.406: U2_IO.4 39.47,2.47 39,2 33,2 31.25,3.75 31.25,10.5 32.75,12 v33,12
U2_RI
  Top 0.406: IC2.6 37.17,7.46 U2_IO.5
U2_RTS  (via drill 0.3)
  Top 0.406: IC2.3 35.23,12.22 34,11 v33,11
  Bottom 0.406: v33,11 32,10 32,4 33,3 36,3 37,4 37,4.6 U2_IO.6
U2_RX
  Top 0.406: IC2.5 36.52,9.53 34.39,7.39 U2_IO.7
U2_TX
  Top 0.406: U2_IO.8 33.33,4.67 31,7 31,12.5 32.52,14.02 IC2.1
U2_VCCIO
  Top 0.406: IC2.4 35.88,15.88 37,17 42,17 44,15 44,14 45.1,12.9 U2_LOGIC.1 U2_LOGIC.3 U2_LOGIC.5
U3_1V8  (via drill 0.3)
  Top 0.406: LDO3_1V8.2 49.06,52.9 C16.1 47.13,53.12 v47,53.25
  Bottom 0.406: v47,53.25 45.78,54.47 U3_LOGIC.6 44.73,59.52 44,60.25 44,63 45.78,64.78 U3_SUPPLY.1
U3_3V3  (via drill 0.3)
  Top 0.406: U3_LOGIC.4 48.32,57.57 47.75,57 44.75,57 v44.25,56.5 | LDO3_3V3.2 52.56,52.06 54,53.5 C28.1 52.45,54.3 v51.25,55.5
  Bottom 0.406: U3_LOGIC.4 48.32,57.43 48.75,57 51.25,57 | 51.25,57 52.25,57 53,57.75 53,63.75 52.5,64.25 49,64.25 48.32,64.93 U3_SUPPLY.3 | v51.25,55.5 51.25,57 | U3.1 43.75,56 v44.25,56.5
U3_5V  (via drill 0.3)
  Top 0.305: v32,52 32,55 31.46,55.54 R11.2 | R12.2 31.26,71.74 v32,71 | 36.08,52 35.25,52 v35,52
  Top 0.406: IC3.20 36.08,52 | C15.1 C18.1 C17.1 35.55,49.45 FB3.2 35.25,52 | C15.1 46.55,49.45 47.02,48.98 LDO3_1V8.3 50,47.75 50.75,47 C27.1 53.55,48.93 LDO3_3V3.3 | C15.1 45.12,53.62 47.25,55.75 49.75,55.75 50.86,56.86 U3_LOGIC.2 50.88,59.5 51.75,59.5 52.5,60.25 52.5,64.5 50.86,66.14 U3_SUPPLY.5
  Bottom 0.305: v32,71 v32,52 v35,52
U3_CTS  (via drill 0.3)
  Top 0.305: v34.75,64.25 34.77,64.22 IC3.11
  Bottom 0.305: U3_IO.1 40.32,71.75 33.75,71.75 33,71 33,66 v34.75,64.25
U3_DCD  (via drill 0.3)
  Top 0.305: IC3.10 35.42,59.33 v35.5,59.25
  Bottom 0.305: v35.5,59.25 41.25,59.25 42.01,60.01 U3_IO.2
U3_DSR  (via drill 0.3)
  Top 0.305: U3_IO.4 39.47,66.22 39.25,66 v35.75,66 | IC3.9 36.08,64.25 v36,64.25
  Bottom 0.305: v35.75,66 35.75,64.5 v36,64.25
U3_DTR  (via drill 0.3)
  Top 0.305: v40.5,64.25 40.62,64.12 IC3.2
  Bottom 0.305: U3_IO.3 40.73,68.78 40.73,64.5 v40.5,64.25
U3_RI  (via drill 0.3)
  Top 0.305: IC3.6 38.02,62.98 v37.75,63.25
  Bottom 0.305: U3_IO.6 36.93,64.07 v37.75,63.25
U3_RTS  (via drill 0.3)
  Top 0.305: v39.36,63.5 39.98,62.88 IC3.3
  Bottom 0.305: U3_IO.5 38.2,68.74 38.2,64.5 39.25,63.5 v39.36,63.5
U3_RX
  Top 0.305: U3_IO.8 34.39,66.11 35.25,65.25 37.75,65.25 38.67,64.33 IC3.5
U3_TX
  Top 0.305: U3_IO.7 34.39,71.89 35,72.5 43.25,72.5 43.75,72 43.75,65.75 41.27,63.27 IC3.1
U3_VCCIO
  Top 0.406: U3_LOGIC.1 U3_LOGIC.3 U3_LOGIC.5 45.06,62.06 44,61 44,60 43,59 40,59 39.33,59.67 IC3.4
U4_1V8  (via drill 0.3)
  Top 0.406: LDO4_1V8.2 21.06,52.85 C20.1 21,53.33 v21,55
  Bottom 0.406: v21,55 19.25,55 18.6,55.65 U4_LOGIC2.6 17.98,59.52 16.75,60.75 16.75,63.25 18.6,65.1 U4_SUPPLY.1
U4_3V3  (via drill 0.3)
  Top 0.406: LDO4_3V3.2 24.81,53.31 | C30.1 25.05,53.55 24.81,53.31 | 24.81,53.31 24.81,55.19 v24,56
  Bottom 0.406: U4_SUPPLY.3 21.14,65.36 21.75,64.75 24.5,64.75 25.25,64 25.25,58 24.75,57.5 24,57.5 | 24,57.5 22.25,57.5 21.14,58.61 U4_LOGIC2.4 | 24,57.5 v24,56 24,54.25 23,53.25 U4.1
U4_5V  (via drill 0.3)
  Top 0.305: v5,52 3.86,50.86 R13.2 | v5,66 4.07,66 R14.2
  Top 0.406: C21.1 C19.1 C22.1 8.91,49.56 FB4.2 9,49.65 v9,52 9.78,52 IC4.20 | C21.1 18.35,48.98 LDO4_1V8.3 LDO4_3V3.3 27.23,48.98 28,49.75 28,50 28.55,50.55 C29.1 | C21.1 18,49.79 18,55.25 19.5,56.75 22.5,56.75 23.68,57.93 U4_LOGIC2.2 24.77,59.52 25.25,60 25.25,64 23.68,65.57 U4_SUPPLY.5
  Bottom 0.305: v5,66 5,53 | 5,53 v5,52 | v9,52 8,53 5,53
U4_CTS  (via drill 0.3)
  Top 0.254: U4_IO.1 14.07,68.75 v9,68.75 | v9,65 8.47,64.47 IC4.11
  Bottom 0.254: v9,68.75 v9,65
U4_DCD  (via drill 0.3)
  Top 0.254: IC4.10 9.12,59.38 v9.5,59
  Bottom 0.305: v9.5,59 12.25,61.75 14.75,61.75 15.38,62.38 U4_IO.2
U4_DSR  (via drill 0.3)
  Top 0.254: IC4.9 9.78,62.77 v10,63
  Bottom 0.254: v10,63 10.25,62.75 13.75,62.75 14,63 14,64.75 12.84,65.91 U4_IO.4
U4_DTR  (via drill 0.3)
  Top 0.254: IC4.2 14.32,65.92 v14.25,66
  Bottom 0.254: U4_IO.3 14.1,68.9 14.1,66.25 v14.25,66
U4_RI  (via drill 0.3)
  Top 0.305: IC4.6 11.72,63.72 v11.44,64
  Bottom 0.305: v11.44,64 10.3,65.14 U4_IO.6
U4_RTS  (via drill 0.3)
  Top 0.254: v13.25,63.5 13.68,63.08 IC4.3
  Bottom 0.254: U4_IO.5 11.6,68.86 11.6,65.77 13.25,64.02 v13.25,63.5
U4_RX
  Top 0.305: U4_IO.8 7.76,66.49 8.5,65.75 11,65.75 12.38,64.38 IC4.5
U4_TX
  Top 0.305: U4_IO.7 7.76,71.01 8.75,72 16.25,72 17,71.25 17,65 14.97,62.98 IC4.1
U4_VCCIO
  Top 0.406: IC4.4 13.03,59.98 14,59 16,59 16.5,59.5 16.5,61.25 17.31,62.06 U4_LOGIC2.5 U4_LOGIC2.3 U4_LOGIC2.1
UART1_D+  (via drill 0.3)
  Top 0.254: FE1.1S.11 v26,41.75
  Top 0.305: IC1.15 15.65,22.09 v14.75,23
  Bottom 0.254: 21.75,37.75 23.5,39.5 24.5,39.5 26,41 v26,41.75
  Bottom 0.305: 14.75,26.75 21.75,33.75 21.75,37.75
  Bottom 0.406: v14.75,23 14.75,26.75
UART1_D-  (via drill 0.3)
  Top 0.254: FE1.1S.10 26.63,38.71 v26.01,38.09
  Top 0.305: v17,21 17,19.75 16.75,19.5 15.75,19.5 15.01,20.25 IC1.16
  Bottom 0.254: 22.25,37.5 23.75,39 25.5,39 26.01,38.49 v26.01,38.09
  Bottom 0.305: 16,27.25 22.25,33.5 22.25,37.5
  Bottom 0.406: v17,21 16,22 16,27.25
UART2_D+  (via drill 0.3)
  Top 0.254: v27.25,42 27.27,41.98 FE1.1S.9
  Top 0.305: IC2.15 42.38,22.62 v42,23
  Bottom 0.254: 33,36 29,36 27.25,37.75 v27.25,42
  Bottom 0.305: 42,27 33,36
  Bottom 0.406: v42,23 42,27
UART2_D-  (via drill 0.3)
  Top 0.254: FE1.1S.8 27.91,38.09 v28,38
  Top 0.305: IC2.16 41.75,21.24 41.75,20 42,19.75 43,19.75 44,20.75 v44,22
  Bottom 0.254: v28,38 29.34,36.66 33.34,36.66
  Bottom 0.305: 33.34,36.66 44,26
  Bottom 0.406: v44,22 44,26
UART3_D+  (via drill 0.3)
  Top 0.254: v29.25,38 28.55,38.7 FE1.1S.7
  Top 0.305: v33.25,49.25 32.83,49.67 IC3.15
  Bottom 0.254: 30,38.5 29.5,38 v29.25,38
  Bottom 0.305: v33.25,49.25 30,46 30,45 30,38.5
UART3_D-  (via drill 0.3)
  Top 0.254: FE1.1S.6 29.19,41.31 v29,41.5
  Top 0.305: IC3.16 33.48,51.77 33.75,51.5 v33.75,51
  Bottom 0.254: v29,41.5 29,45
  Bottom 0.305: v33.75,51 29,46.25 29,45
UART4_D+  (via drill 0.3)
  Top 0.254: FE1.1S.5 29.83,38.35 29.91,38.27 29.91,38.09 v30.5,37.5 | v31.25,42 31.25,42.25 29.75,43.75 26.25,43.75 v25.75,44.25
  Top 0.305: IC4.15 6.53,52.52 v6,52
  Bottom 0.254: v30.5,37.5 31.25,38.25 v31.25,42
  Bottom 0.305: v6,52 13.75,44.25 23.25,44.25 v25.75,44.25
UART4_D-  (via drill 0.3)
  Top 0.254: v27.75,43 28.75,43 30.47,41.28 FE1.1S.4
  Top 0.305: IC4.16 7.17,50.92 v6.5,50.25
  Bottom 0.305: v6.5,50.25 13.75,43 23,43 v27.75,43
VCC  (via drill 0.3)
  Top 0.254: FE1.1S.20 27.27,36.23 26.75,36.75 24.5,36.75 22.5,38.75 22.5,39.75 22.34,39.91 21.34,39.91 | R6.2 18.22,30.47 17.5,29.75 14.25,29.75 13.75,30.25 8.89,30.25
  Top 0.305: C2.1 11.75,39.91 11.75,40.16 | 11.75,40.16 10.16,40.16 9.98,39.98 9.98,39.5 | 11.75,40.16 11.75,43.5 13.75,45.5 v16.25,45.5
  Top 0.406: C2.1 C1.1 21.34,39.91 | CN1.VBUS 9.98,39.5 9.98,40.52 6.35,44.15 U4_EN.1 | U1_EN.1 8.89,30.25 | U2_EN.1 35.96,28.5 45,28.5 46.5,30 46.5,45 45.75,45.75 38.25,45.75 37.5,45 37.5,43.25 36.5,42.25 33.75,42.25 32.58,43.42 U3_EN.1 32.58,47.67 31.5,48.75 v30.25,48.75
  Bottom 0.305: v16.25,45.5 23.75,45.5 27,48.75 v30.25,48.75
  Bottom 0.406: CN1.VBUS 11.68,38.57 12.25,38 12.25,33.75 11,32.5 10.25,32.5 8.89,31.14 U1_EN.1
XIN
  Top 0.305: FE1.1S.3 31.11,37.89 32,37 41,37 41.87,36.13 Q1.1
XOUT
  Top 0.305: FE1.1S.2 31.75,38.25 32,38 41,38 41.87,38.87 Q1.2

### Text on the board
tPlace: TX | RTS | DTR | CTS | TX | RTS | DTR | CTS | RX | RI | DSR | DCD | RX | RI | DSR | DCD | 1V8 | 3V3 | 5V | 1V8 | 3V3 | 5V | USB HUB + 4x UART FTDI | 1V8 | 3V3 | 5V | 1V8 | 3V3 | 5V | RX | RI | DSR | DCD | RX | RI | DSR | DCD | TX | RTS | DTR | CTS | TX | RTS | DTR | CTS
tNames: Version 1.1 | miroslav.pivovarsky@gmail.com